# EasyEDA Pro project G474VET6_V3.1.eprj

# Schematic Schematic1
Board Name: Board1; Page Size: A3
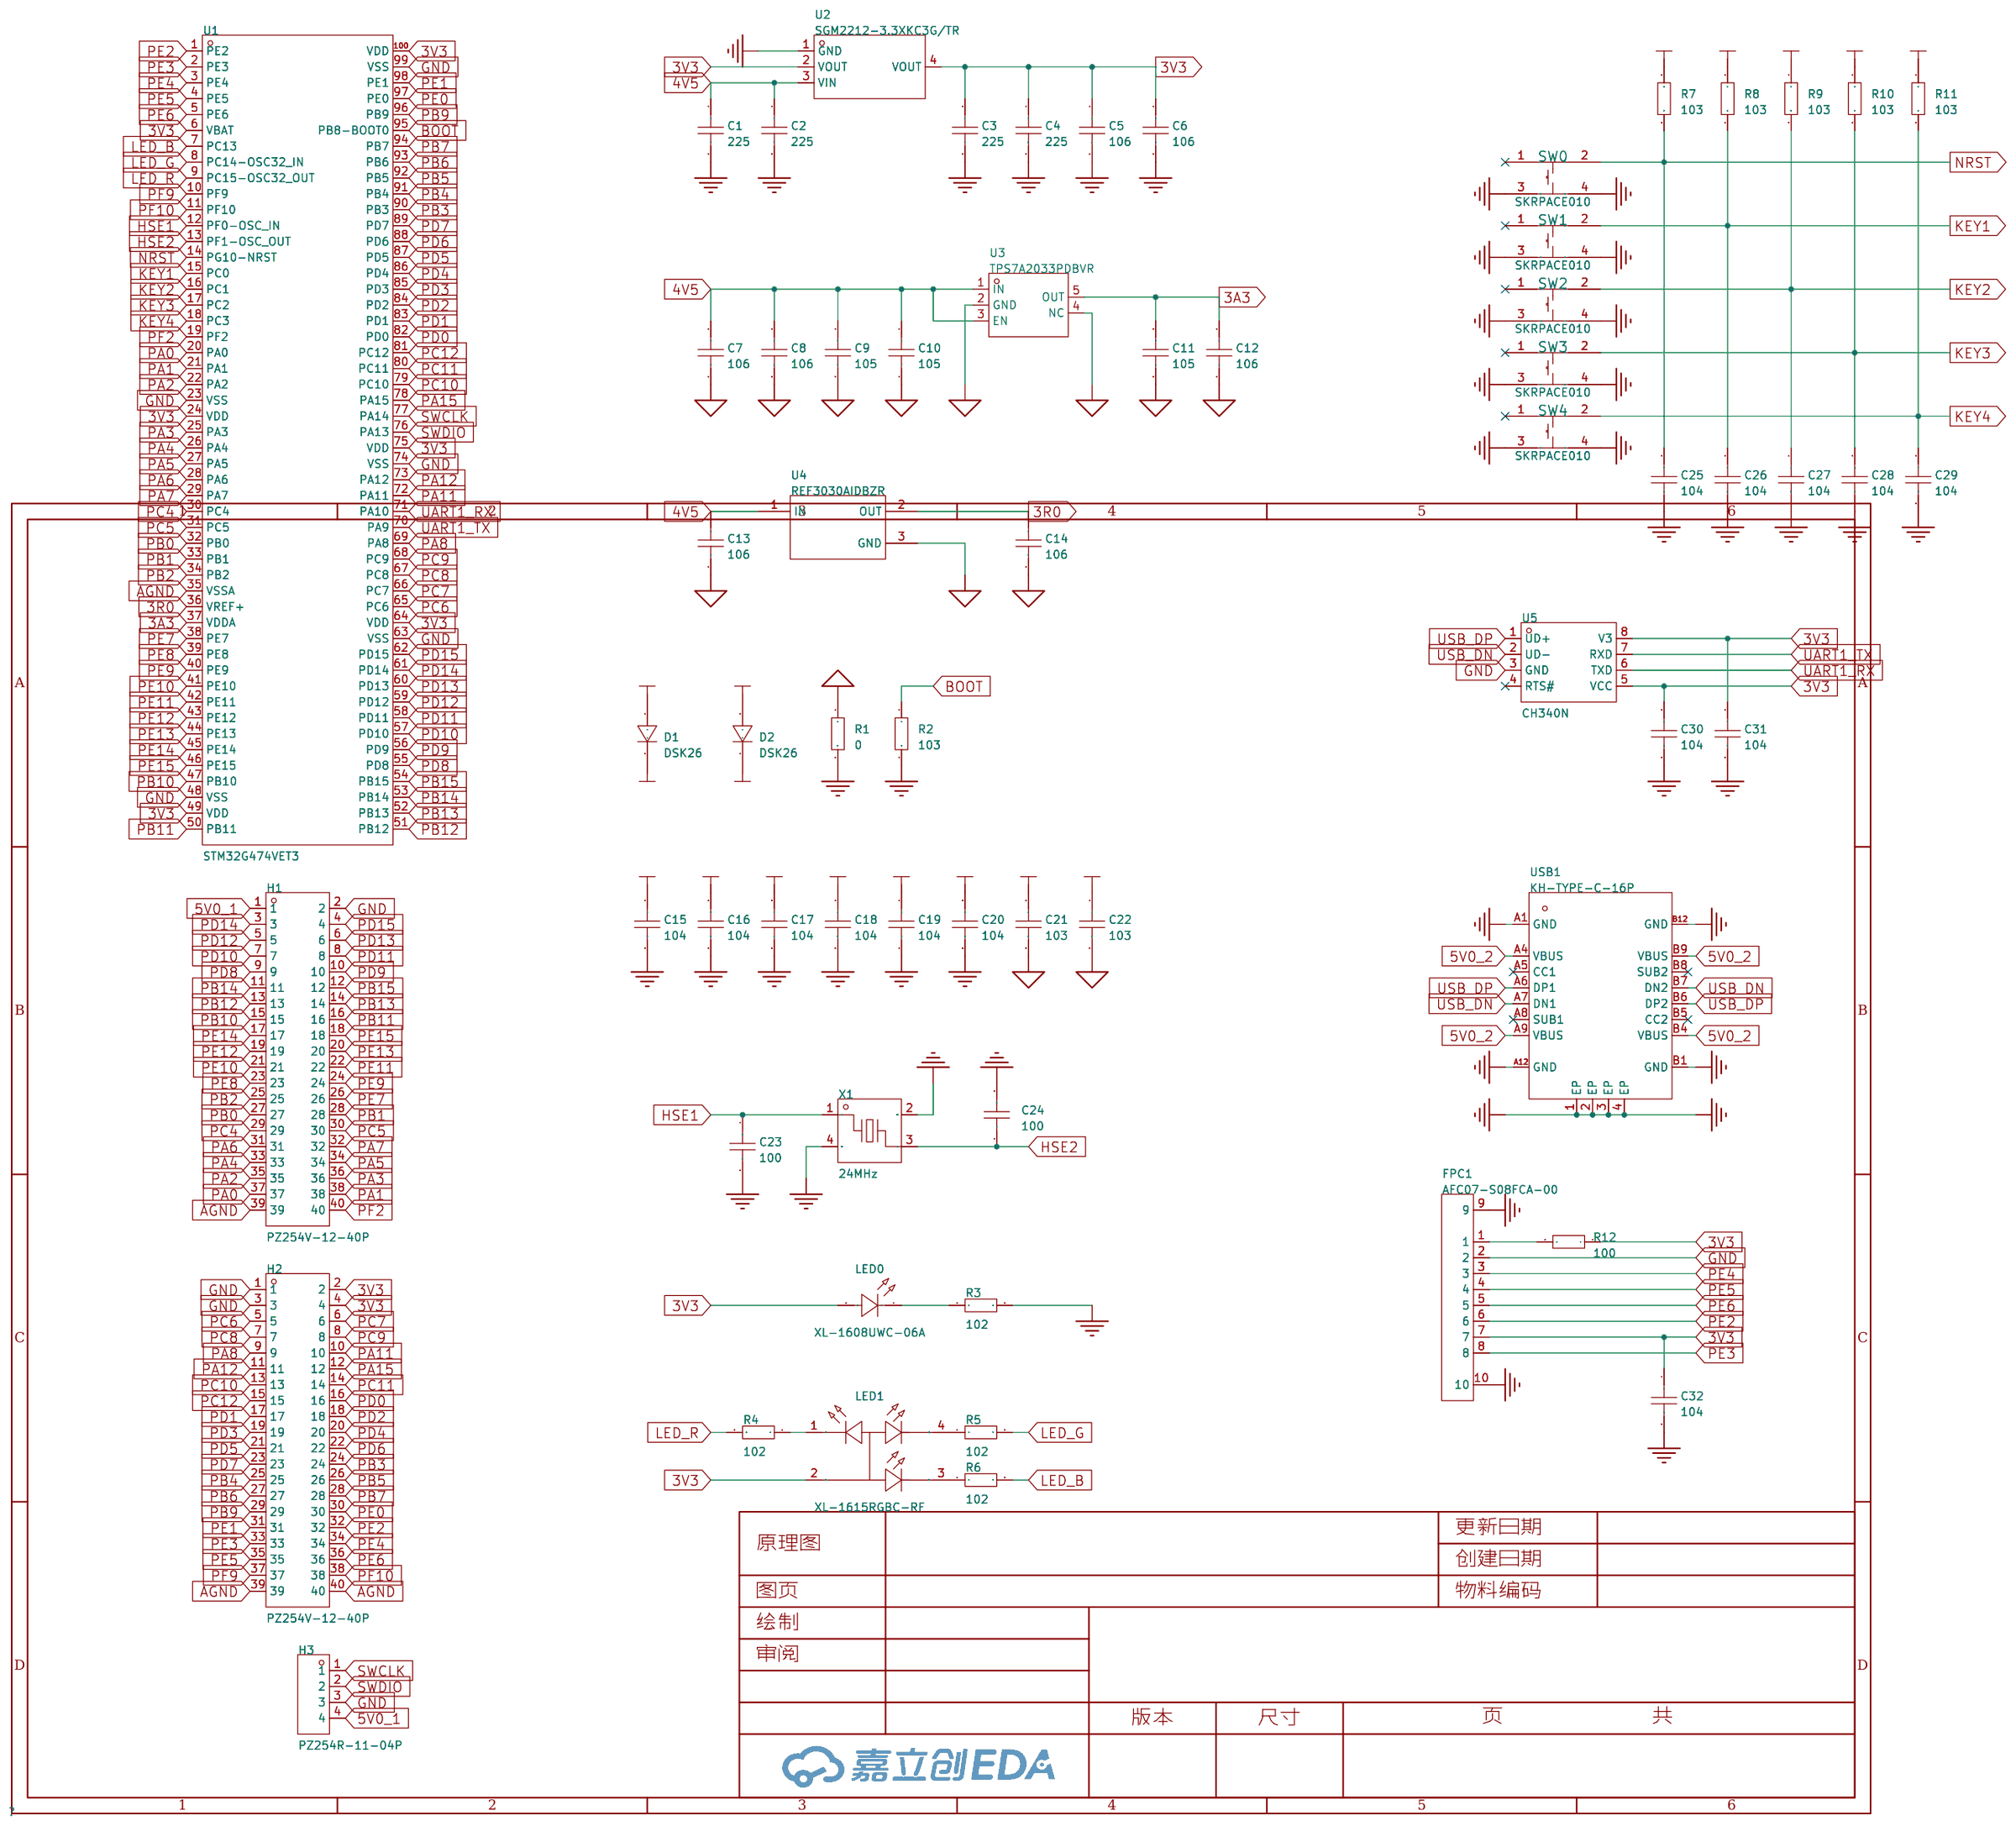
[diagram p0: schematic sheet]

## Parts
C1  225  [C0603]
C2  225  [C0603]
C3  225  [C0603]
C4  225  [C0603]
C5  106  [C0603]
C6  106  [C0603]
C7  106  [C0603]
C8  106  [C0603]
C9  105  [C0603]
C10  105  [C0603]
C11  105  [C0603]
C12  106  [C0603]
C13  106  [C0603]
C14  106  [C0603]
C15  104  [C0603]
C16  104  [C0603]
C17  104  [C0603]
C18  104  [C0603]
C19  104  [C0603]
C20  104  [C0603]
C21  103  [C0603]
C22  103  [C0603]
C23  100  [C0603]
C24  100  [C0603]
C25  104  [C0603]
C26  104  [C0603]
C27  104  [C0603]
C28  104  [C0603]
C29  104  [C0603]
C30  104  [C0603]
C31  104  [C0603]
C32  104  [C0603]
D1  DSK26  [SOD-123_L2.8-W1.8-LS3.7-RD]
D2  DSK26  [SOD-123_L2.8-W1.8-LS3.7-RD]
FPC1  AFC07-S08FCA-00  [FPC-SMD_AFC07-S08FCA-00]
H1  PZ254V-12-40P  [HDR-TH_40P-P2.54-V-M-R2-C20-S2.54_2-146257-0]
H2  PZ254V-12-40P  [HDR-TH_40P-P2.54-V-M-R2-C20-S2.54_2-146257-0]
H3  PZ254R-11-04P  [HDR-TH_4P-P2.54-H-M-W10.4]
LED0  XL-1608UWC-06A  [LED0603-RD_1]
LED1  XL-1615RGBC-RF  [LED-ARRAY-SMD_4P-L1.6-W1.5-BR_XL-1615RGBC-RF]
R1  0  [R0603]
R2  103  [R0603]
R3  102  [R0603]
R4  102  [R0603]
R5  102  [R0603]
R6  102  [R0603]
R7  103  [R0603]
R8  103  [R0603]
R9  103  [R0603]
R10  103  [R0603]
R11  103  [R0603]
R12  100  [R0603]
SW0  SKRPACE010  [KEY-SMD_4P-L4.2-W3.2-P2.20-LS4.6]
SW1  SKRPACE010  [KEY-SMD_4P-L4.2-W3.2-P2.20-LS4.6]
SW2  SKRPACE010  [KEY-SMD_4P-L4.2-W3.2-P2.20-LS4.6]
SW3  SKRPACE010  [KEY-SMD_4P-L4.2-W3.2-P2.20-LS4.6]
SW4  SKRPACE010  [KEY-SMD_4P-L4.2-W3.2-P2.20-LS4.6]
U1  STM32G474VET3  [LQFP-100_L14.0-W14.0-P0.50-LS16.0-BL]
U2  SGM2212-3.3XKC3G/TR  [SOT-223-3_L6.5-W3.4-P2.30-LS7.0-BR]
U3  TPS7A2033PDBVR  [SOT-23-5_L2.9-W1.6-P0.95-LS2.8-BR]
U4  REF3030AIDBZR  [SOT-23-3_L2.9-W1.6-P1.90-LS2.8-BR]
U5  CH340N  [SOP-8_L4.9-W3.9-P1.27-LS6.0-BL]
USB1  KH-TYPE-C-16P  [USB-C-SMD_KH-TYPE-C-16P]
X1  24MHz  [CRYSTAL-SMD_4P-L2.0-W1.6-BL]

## Library data of the parts
C1-C32 = CAP_0603: Supplier Footprint: 0603
D1 D2 = DSK26_C50553: LCSC Part Name: 电压:60V 电流:2A; Supplier Part: C50553; Manufacturer: MDD(辰达半导体); Supplier Footprint: SOD-123FL; JLCPCB Part Class: 扩展库; Datasheet: https://atta.szlcsc.com/upload/public/pdf/source/20230823/D3EA44505E795B66956504010A0876FD.pdf; Supplier: LCSC; Diode Configuration: 独立式; Forward Voltage (Vf@If): 700mV@2A; Reverse Voltage (Vr): 60V; Rectified Current: 2A; Reverse Leakage Current (Ir): 500uA@60V
FPC1 = AFC07-S08FCA-00: LCSC Part Name: 间距:0.5mm P数:8P 抽屉式 下接; Supplier Part: C262555; Manufacturer: JS(钜硕电子); Supplier Footprint: SMD,P=0.5mm,卧贴; JLCPCB Part Class: 扩展库; Datasheet: https://atta.szlcsc.com/upload/public/pdf/source/20190726/C11047_78689421E6D6672DE8D11ECCF89B3729.pdf; Supplier: LCSC; Locking Feature: 抽屉式; Contact Type: 下接; Number of Contacts: 8P; Pitch: 0.5mm; Mounting Type: 卧贴; FFC, FCB Thickness: 0.3mm; Height Above Board: 2mm
H1 H2 = PZ254V-12-40P: LCSC Part Name: 排针2.54mm间距 双排 2x20P 直插 方针; Supplier Part: C22465944; Manufacturer: XFCN(兴飞); Supplier Footprint: 插件,P=2.54mm; JLCPCB Part Class: 扩展库; Datasheet: https://atta.szlcsc.com/upload/public/pdf/source/20240617/7BDC3EEBCF4C501A0924363F71CB3FB4.pdf; Supplier: LCSC
H3 = PZ254R-11-04P: LCSC Part Name: 间距:2.54mm 1x4P 弯插 方针; Supplier Part: C492412; Manufacturer: XFCN(兴飞); Supplier Footprint: 弯插,P=2.54mm; JLCPCB Part Class: 扩展库; Datasheet: https://atta.szlcsc.com/upload/public/pdf/source/20200309/C492412_B0EFFC1946AB079B8871416C4A09EF6C.pdf; Supplier: LCSC; Pin Structure: 1x4P; Pitch: 2.54mm; Circluar Pins/Square Pins: 方针; Mounting Type: 弯插; Number of Rows: 单排; Number of Pins: 4P; Length of Mating Pin: 6mm; Insulation Height: 2.5mm; Contact Material: 黄铜; Operating Temperature Range: -40℃~+105℃; Color: 黑色
LED0 = XL-1608UWC-06A: Supplier Part: C7371902; Manufacturer: XINGLIGHT(成兴光); Supplier Footprint: 0603; JLCPCB Part Class: 扩展库; Datasheet: https://atta.szlcsc.com/upload/public/pdf/source/20240218/5027756BA733C769FB74797569466480.pdf; Supplier: LCSC; Emitted Color: 白色; Forward Voltage (VF): 2.7V~3.1V; Power Dissipation: 75mW; Forward Current: 5mA; Lens Color: 黄色透镜; Color Temperature: 14000K; Luminous Intensity: 380mcd; Viewing Angle: 120°; Mounting Sytle: 正贴
LED1 = XL-1615RGBC-RF: Supplier Part: C965840; Manufacturer: XINGLIGHT(成兴光); Supplier Footprint: 0606; JLCPCB Part Class: 扩展库; Datasheet: https://atta.szlcsc.com/upload/public/pdf/source/20221102/F1B1FC7E45BA82C0C0D2B0679BEE9200.pdf; Supplier: LCSC
R1-R12 = Res_0603: Supplier Footprint: 0603
SW0-SW4 = SKRPACE010: LCSC Part Name: 4.2*3.2*2.5mm 立贴 轻触开关; Supplier Part: C139797; Manufacturer: ALPSALPINE(阿尔卑斯阿尔派); Supplier Footprint: SMD; JLCPCB Part Class: 扩展库; Datasheet: https://atta.szlcsc.com/upload/public/pdf/source/20171113/C139797_15105612676371115729.pdf; Supplier: LCSC; Circuit: 单刀单掷; Actuator Style: 椭圆形按钮; Mounting Style: 立贴; Switch Length: 4.2mm; Switch Width: 3.2mm; Switch Height: 2.5mm; Contact Current: 50mA; Voltage Rating (DC): 16V
U1 = STM32G474VET3: LCSC Part Name: 带DSP和FPU的170MHz主流ARM Cortex-M4 MCU，具有512 KB Flash存储器、数学加速器、高分辨率定时器和高模拟电平集成; Supplier Part: C2970837; Manufacturer: ST(意法半导体); Supplier Footprint: LQFP-100(14x14); JLCPCB Part Class: Extended Part; Datasheet: https://atta.szlcsc.com/upload/public/pdf/source/20221107/1C05EB05E61A1774C91EF6DD7B13AC34.pdf; Supplier: LCSC; Program Storage Size: 512KB; GPIO Ports Number: 86; Operating Voltage Range: 1.71V~3.6V; CPU Maximum Speed: 170MHz; Operating Temperature Range: -40℃~+125℃; ADC (Bit): 12bit; DAC (Bit): 12bit; Watchdog: 有; Infrared Data Association: 有; Low-Voltage Detect: 有; Direct Memory Access: 有; Internal Oscillator: 有
U2 = SGM2212-3.3XKC3G/TR_C3294699: Supplier Part: C3294699; Manufacturer: SGMICRO(圣邦微); Supplier Footprint: SOT-223-3; JLCPCB Part Class: 扩展库; Supplier: LCSC
U3 = TPS7A2033PDBVR: LCSC Part Name: 具有高 PSRR 的 300mA、超低噪声、低 IQ、低压降 (LDO) 线性稳压器; Supplier Part: C2862740; Manufacturer: TI(德州仪器); Supplier Footprint: SOT-23-5; JLCPCB Part Class: 扩展库; Datasheet: https://www.ti.com/cn/lit/gpn/tps7a20; Supplier: LCSC; Output Type: 固定; Maximum Input Voltage: 6V; Output Voltage: 3.3V; Output Current: 300mA; Dropout Voltage: 140mV@(300mA); standby current: 15uA; Feature: 防静电保护；软启动；浪涌保护；低ESR；热保护(TSD)；欠压闭锁；过流保护(OCP)；带使能；防倒灌; Operating Temperature: -40℃~+125℃@(Tj); Output Polarity: 正极; Number of Outputs: 1
U4 = REF3030AIDBZR: Supplier Part: C38423; Manufacturer: TI(德州仪器); Supplier Footprint: SOT-23; JLCPCB Part Class: 扩展库; Datasheet: https://www.ti.com/cn/lit/gpn/ref3020; Supplier: LCSC; Output Type: 固定; Input Voltage: 3.05V~5.5V; Output Voltage: 3V; Output Current: 25mA; Tolerance: ±0.2%; Temperature Coefficient: 75ppm/℃; Reference Type: 串联; Supply Current: 50uA; Noise - 10Hz to 10kHz: 94uVrms; Operating Temperature: -40℃~+125℃@(Ta)
U5 = CH340N: LCSC Part Name: USB转串口芯片 CH340; Supplier Part: C2977777; Manufacturer: WCH(南京沁恒); Supplier Footprint: SOP-8; JLCPCB Part Class: Extended Part; Datasheet: https://atta.szlcsc.com/upload/public/pdf/source/20230530/6E401E9554E9F5311886CC8B3F89B62E.pdf; Supplier: LCSC
USB1 = KH-TYPE-C-16P: LCSC Part Name: Type-C 母 卧贴; Supplier Part: C709357; Manufacturer: kinghelm(金航标); Supplier Footprint: SMD; JLCPCB Part Class: Extended Part; Datasheet: https://atta.szlcsc.com/upload/public/pdf/source/20200911/C709357_AA8DCEB38BB20E3035A7ED7AE7667837.pdf; Supplier: LCSC; Connector Type: Type-C; Gender: 母; Number of Ports: 1; Number of Contacts: 16P; Mounting Style: 卧贴; Current Rating - Power (Max): 3A; Operating Temperature Range: -40℃~+85℃
X1 = XL7EL89CMI-111YLC-24M: LCSC Part Name: 24MHz ±10ppm 10pF; Supplier Part: C2965581; Manufacturer: YXC(扬兴晶振); Supplier Footprint: SMD2016-4P; JLCPCB Part Class: 扩展库; Datasheet: https://atta.szlcsc.com/upload/public/pdf/source/20240329/C26C9A15A73CBCFBF373B30A8E126750.pdf; Supplier: LCSC; Crystal Type: 贴片晶振; Normal temperature Frequency Tolerance: ±10ppm; External load capacitor: 10pF; Frequency Stability(Full temperature range): ±20ppm; Operating Temperature: -40℃~+85℃

## Nets
3V3: C3.1 C4.1 C5.1 C6.1 C15.1 C16.1 C17.1 C18.1 C19.1 C20.1 C30.1 C31.1 C32.1 FPC1.7 H2.2 H2.4 LED0.2(A) LED1.2(COM+) R7.1 R8.1 R9.1 R10.1 R11.1 R12.1 U1.6(VBAT) U1.24(VDD) U1.49(VDD) U1.64(VDD) U1.75(VDD) U1.100(VDD) U2.2(VOUT) U2.4(VOUT) U5.5(VCC) U5.8(V3)
4V5: C1.1 C2.1 C7.1 C8.1 C9.1 C10.1 C13.1 D1.1(K) D2.1(K) U2.3(VIN) U3.1(IN) U3.3(EN) U4.1(IN)
5V0_1: D1.2(A) H1.1 H3.4
5V0_2: D2.2(A) USB1.A4(VBUS) USB1.A9(VBUS) USB1.B4(VBUS) USB1.B9(VBUS)
AGND: C7.2 C8.2 C9.2 C10.2 C11.2 C12.2 C13.2 C14.2 C21.2 C22.2 H1.39 H2.39 H2.40 R1.1 U1.35(VSSA) U3.2(GND) U3.4(NC) U4.3(GND)
GND: C1.2 C2.2 C3.2 C4.2 C5.2 C6.2 C15.2 C16.2 C17.2 C18.2 C19.2 C20.2 C23.2 C24.2 C25.2 C26.2 C27.2 C28.2 C29.2 C30.2 C31.2 C32.2 FPC1.2 FPC1.9 FPC1.10 H1.2 H2.1 H2.3 H3.3 R1.2 R2.2 R3.2 SW0.3 SW0.4 SW1.3 SW1.4 SW2.3 SW2.4 SW3.3 SW3.4 SW4.3 SW4.4 U1.23(VSS) U1.48(VSS) U1.63(VSS) U1.74(VSS) U1.99(VSS) U2.1(GND) U5.3(GND) USB1.1(EP) USB1.2(EP) USB1.3(EP) USB1.4(EP) USB1.A1(GND) USB1.A12(GND) USB1.B1(GND) USB1.B12(GND) X1.2(GND) X1.4(GND)
3A3: C11.1 C12.1 C21.1 U1.37(VDDA) U3.5(OUT)
3R0: C14.1 C22.1 U1.36(VREF+) U4.2(OUT)
BOOT: R2.1 U1.95(PB8-BOOT0)
HSE1: C23.1 U1.12(PF0-OSC_IN) X1.1
HSE2: C24.1 U1.13(PF1-OSC_OUT) X1.3
KEY1: C26.1 R8.2 SW1.2 U1.15(PC0)
KEY2: C27.1 R9.2 SW2.2 U1.16(PC1)
KEY3: C28.1 R10.2 SW3.2 U1.17(PC2)
KEY4: C29.1 R11.2 SW4.2 U1.18(PC3)
LED_B: R6.2 U1.7(PC13)
LED_G: R5.2 U1.8(PC14-OSC32_IN)
LED_R: R4.2 U1.9(PC15-OSC32_OUT)
NRST: C25.1 R7.2 SW0.2 U1.14(PG10-NRST)
PA0: H1.37 U1.20(PA0)
PA1: H1.38 U1.21(PA1)
PA2: H1.35 U1.22(PA2)
PA3: H1.36 U1.25(PA3)
PA4: H1.33 U1.26(PA4)
PA5: H1.34 U1.27(PA5)
PA6: H1.31 U1.28(PA6)
PA7: H1.32 U1.29(PA7)
PA8: H2.9 U1.69(PA8)
PA11: H2.10 U1.72(PA11)
PA12: H2.11 U1.73(PA12)
PA15: H2.12 U1.78(PA15)
PB0: H1.27 U1.32(PB0)
PB1: H1.28 U1.33(PB1)
PB2: H1.25 U1.34(PB2)
PB3: H2.24 U1.90(PB3)
PB4: H2.25 U1.91(PB4)
PB5: H2.26 U1.92(PB5)
PB6: H2.27 U1.93(PB6)
PB7: H2.28 U1.94(PB7)
PB9: H2.29 U1.96(PB9)
PB10: H1.15 U1.47(PB10)
PB11: H1.16 U1.50(PB11)
PB12: H1.13 U1.51(PB12)
PB13: H1.14 U1.52(PB13)
PB14: H1.11 U1.53(PB14)
PB15: H1.12 U1.54(PB15)
PC4: H1.29 U1.30(PC4)
PC5: H1.30 U1.31(PC5)
PC6: H2.5 U1.65(PC6)
PC7: H2.6 U1.66(PC7)
PC8: H2.7 U1.67(PC8)
PC9: H2.8 U1.68(PC9)
PC10: H2.13 U1.79(PC10)
PC11: H2.14 U1.80(PC11)
PC12: H2.15 U1.81(PC12)
PD0: H2.16 U1.82(PD0)
PD1: H2.17 U1.83(PD1)
PD2: H2.18 U1.84(PD2)
PD3: H2.19 U1.85(PD3)
PD4: H2.20 U1.86(PD4)
PD5: H2.21 U1.87(PD5)
PD6: H2.22 U1.88(PD6)
PD7: H2.23 U1.89(PD7)
PD8: H1.9 U1.55(PD8)
PD9: H1.10 U1.56(PD9)
PD10: H1.7 U1.57(PD10)
PD11: H1.8 U1.58(PD11)
PD12: H1.5 U1.59(PD12)
PD13: H1.6 U1.60(PD13)
PD14: H1.3 U1.61(PD14)
PD15: H1.4 U1.62(PD15)
PE0: H2.30 U1.97(PE0)
PE1: H2.31 U1.98(PE1)
PE2: FPC1.6 H2.32 U1.1(PE2)
PE3: FPC1.8 H2.33 U1.2(PE3)
PE4: FPC1.3 H2.34 U1.3(PE4)
PE5: FPC1.4 H2.35 U1.4(PE5)
PE6: FPC1.5 H2.36 U1.5(PE6)
PE7: H1.26 U1.38(PE7)
PE8: H1.23 U1.39(PE8)
PE9: H1.24 U1.40(PE9)
PE10: H1.21 U1.41(PE10)
PE11: H1.22 U1.42(PE11)
PE12: H1.19 U1.43(PE12)
PE13: H1.20 U1.44(PE13)
PE14: H1.17 U1.45(PE14)
PE15: H1.18 U1.46(PE15)
PF2: H1.40 U1.19(PF2)
PF9: H2.37 U1.10(PF9)
PF10: H2.38 U1.11(PF10)
SWCLK: H3.1 U1.77(PA14)
SWDIO: H3.2 U1.76(PA13)
UART1_RX: U1.71(PA10) U5.6(TXD)
UART1_TX: U1.70(PA9) U5.7(RXD)
USB_DN: U5.2(UD-) USB1.A7(DN1) USB1.B7(DN2)
USB_DP: U5.1(UD+) USB1.A6(DP1) USB1.B6(DP2)
$1N5162: LED0.1(K) R3.1
$1N5238: LED1.1(R-) R4.1
$1N5301: LED1.4(G-) R5.1
$1N5327: LED1.3(B-) R6.1
$1N6659: FPC1.1 R12.2

Not connected (* = marked no-connect by the designer): SW0 1*; SW1 1*; SW2 1*; SW3 1*; SW4 1*; U5 4(RTS#)*; USB1 A5(CC1)* A8(SUB1)* B5(CC2)* B8(SUB2)*

# Board PCB1
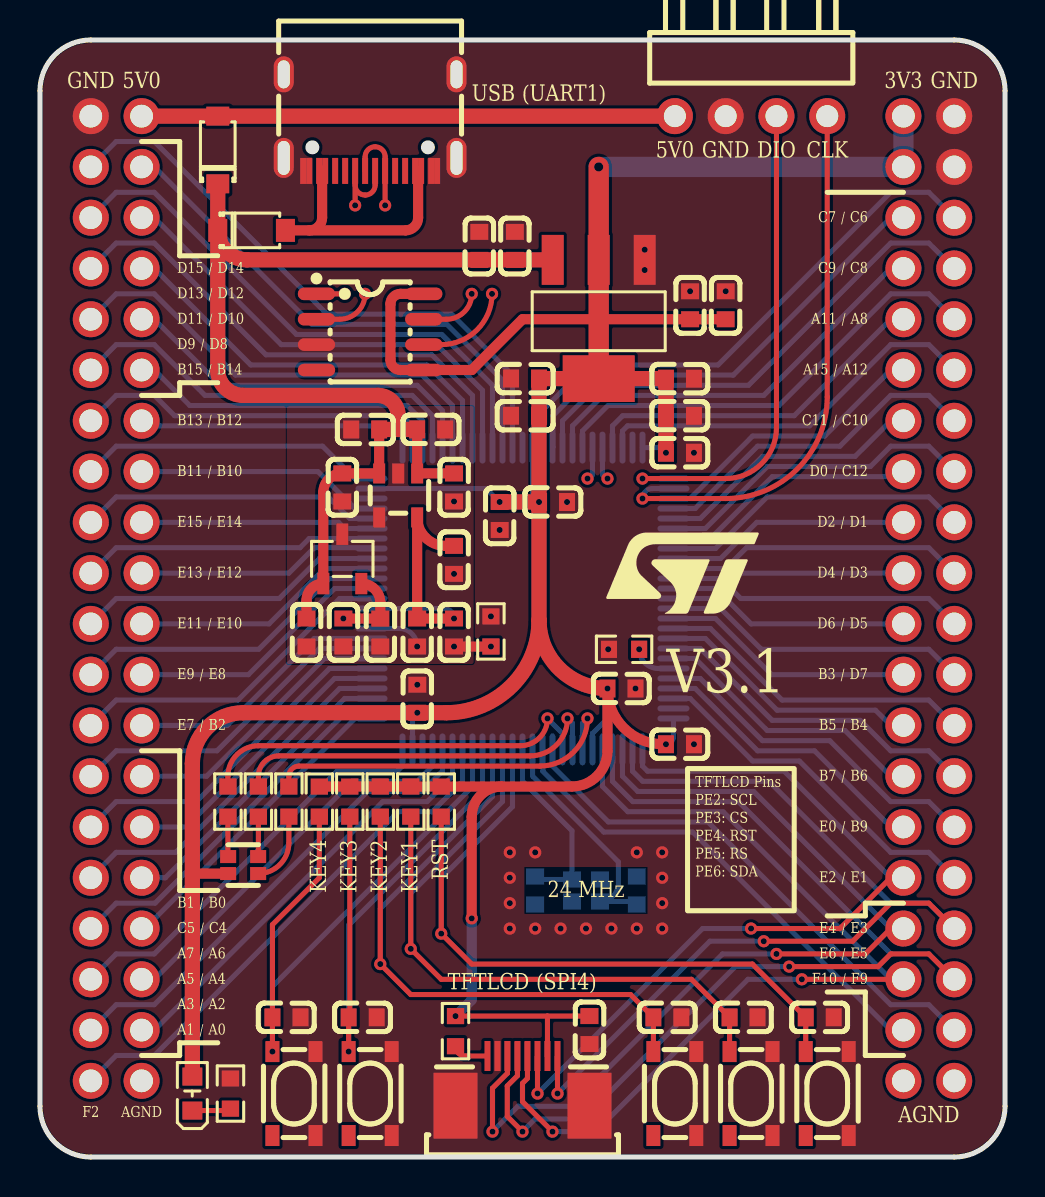
[diagram p1: board, top side]
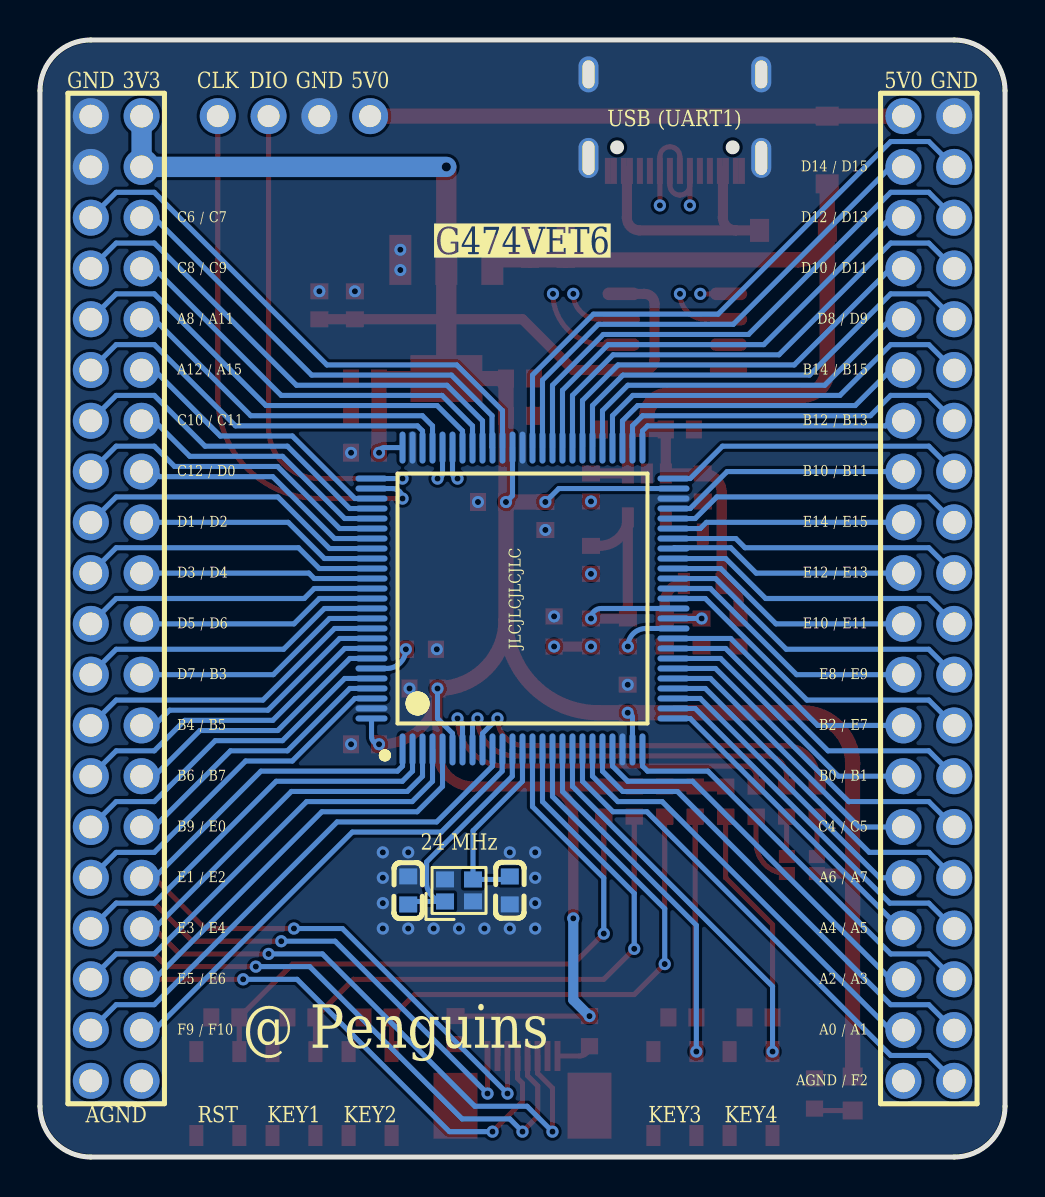
[diagram p2: board, bottom side, seen from below]

Outline 48.26 x 55.88 mm; copper layers: Top Layer, Inner1, 内层2, Bottom Layer. Coordinates in mm from the lower left corner of the outline.
Outline path: 0,53.34 0,2.54 arc(0.74,0.74) 2.54,0 45.72,0 arc(47.52,0.74) 48.26,2.54 48.26,53.34 arc(47.52,55.14) 45.72,55.88 2.54,55.88 arc(0.74,55.14) 0,53.34
Stack: Top Layer 0.035mm 外层铜厚1oz / Dielectric1 0.2104mm 7628 RC49% 8.6mil / Inner1 0.0152mm 内层铜厚 / Dielectric2 1.065mm 1.1mm H/HOZ Copper / 内层2 0.0152mm 内层铜厚 / Dielectric3 0.2104mm 7628 RC49% 8.6mil / Bottom Layer 0.035mm 外层铜厚1oz

## Design rules (mm)
template: 自定义配置
spacing copperThickness1oz (default): track to track 0.102, other pairs 0.152 to 0.3
spacing copperThickness2oz: track to track 0.203, other pairs 0.152 to 0.3
track width copperThickness1oz (default): min 0.127, default 0.254, max 2.54
track width copperThickness2oz: min 0.203, default 0.254, max 2.54
differential pair differentialPair (default): width min 0.127, default 0.254, max 2.54; gap min 0.152, default 0.152
via viaSize (default): diameter min 0.5, default 0.61, max 10; hole min 0.3, default 0.305, max 6.3

## Placement (name value [footprint] x y rotation side)
C1  225  [C0603]  21.97 45.58 90 top
C2  225  [C0603]  23.75 45.58 90 top
C3  225  [C0603]  24.26 38.94 180 top
C4  225  [C0603]  32 38.94 0 top
C5  106  [C0603]  24.26 37.08 180 top
C6  106  [C0603]  32 37.08 0 top
C7  106  [C0603]  16.26 36.4 180 top
C8  106  [C0603]  19.56 36.4 0 top
C9  105  [C0603]  15.12 33.5 270 top
C10  105  [C0603]  20.71 33.5 270 top
C11  105  [C0603]  20.71 29.87 270 top
C12  106  [C0603]  18.86 26.24 270 top
C13  106  [C0603]  13.33 26.24 270 top
C14  106  [C0603]  17.02 26.24 270 top
C15  104  [C0603]  18.87 22.92 90 top
C16  104  [C0603]  22.99 32.07 270 top
C17  104  [C0603]  25.66 32.77 0 top
C18  104  [C0603]  32 35.23 0 top
C19  104  [C0603]  32 20.65 0 top
C20  104  [C0603]  29.08 23.44 0 top
C21  103  [C0603]  20.71 26.24 270 top
C22  103  [C0603]  15.17 26.24 270 top
C23  100  [C0603]  29.84 13.33 90 bottom
C24  100  [C0603]  24.76 13.33 270 bottom
C25  104  [C0603]  39 6.98 0 top
C26  104  [C0603]  35.19 6.98 0 top
C27  104  [C0603]  31.38 6.98 0 top
C28  104  [C0603]  16.13 6.98 0 top
C29  104  [C0603]  12.32 6.98 0 top
C30  104  [C0603]  32.51 42.61 90 top
C31  104  [C0603]  34.29 42.61 90 top
C32  104  [C0603]  27.48 6.35 270 top
D1  DSK26  [SOD-123_L2.8-W1.8-LS3.7-RD]  8.89 50.38 90 top
D2  DSK26  [SOD-123_L2.8-W1.8-LS3.7-RD]  10.58 46.36 0 top
FPC1  AFC07-S08FCA-00  [FPC-SMD_AFC07-S08FCA-00]  24.13 3.81 0 top
H1  PZ254V-12-40P  [HDR-TH_40P-P2.54-V-M-R2-C20-S2.54_2-146257-0]  3.81 27.94 270 bottom
H2  PZ254V-12-40P  [HDR-TH_40P-P2.54-V-M-R2-C20-S2.54_2-146257-0]  44.45 27.94 270 bottom
H3  PZ254R-11-04P  [HDR-TH_4P-P2.54-H-M-W10.4]  35.56 52.07 180 top
LED0  XL-1608UWC-06A  [LED0603-RD_1]  7.62 3.18 90 top
LED1  XL-1615RGBC-RF  [LED-ARRAY-SMD_4P-L1.6-W1.5-BR_XL-1615RGBC-RF]  10.16 14.61 180 top
R1  0  [R0603]  22.55 26.29 90 top
R2  103  [R0603]  29.21 25.4 180 top
R3  102  [R0603]  9.53 3.18 90 top
R4  102  [R0603]  9.4 17.78 90 top
R5  102  [R0603]  10.92 17.78 90 top
R6  102  [R0603]  12.45 17.78 90 top
R7  103  [R0603]  20.07 17.78 270 top
R8  103  [R0603]  18.54 17.78 270 top
R9  103  [R0603]  17.02 17.78 270 top
R10  103  [R0603]  15.49 17.78 270 top
R11  103  [R0603]  13.97 17.78 270 top
R12  100  [R0603]  20.78 6.3 270 top
SW0  SKRPACE010  [KEY-SMD_4P-L4.2-W3.2-P2.20-LS4.6]  39.37 3.18 90 top
SW1  SKRPACE010  [KEY-SMD_4P-L4.2-W3.2-P2.20-LS4.6]  35.56 3.18 90 top
SW2  SKRPACE010  [KEY-SMD_4P-L4.2-W3.2-P2.20-LS4.6]  31.75 3.18 90 top
SW3  SKRPACE010  [KEY-SMD_4P-L4.2-W3.2-P2.20-LS4.6]  16.51 3.18 90 top
SW4  SKRPACE010  [KEY-SMD_4P-L4.2-W3.2-P2.20-LS4.6]  12.7 3.18 90 top
U1  STM32G474VET3  [LQFP-100_L14.0-W14.0-P0.50-LS16.0-BL]  24.13 27.94 180 bottom
U2  SGM2212-3.3XKC3G/TR  [SOT-223-3_L6.5-W3.4-P2.30-LS7.0-BR]  27.94 41.91 90 top
U3  TPS7A2033PDBVR  [SOT-23-5_L2.9-W1.6-P0.95-LS2.8-BR]  17.91 33.1 90 top
U4  REF3030AIDBZR  [SOT-23-3_L2.9-W1.6-P1.90-LS2.8-BR]  15.12 29.92 270 top
U5  CH340N  [SOP-8_L4.9-W3.9-P1.27-LS6.0-BL]  16.51 41.27 270 top
USB1  KH-TYPE-C-16P  [USB-C-SMD_KH-TYPE-C-16P]  16.51 51.75 180 top
X1  24MHz  [CRYSTAL-SMD_4P-L2.0-W1.6-BL]  27.31 13.33 180 bottom

## Footprints (pads in the part's own frame, mm; a bottom-side part is the same pattern mirrored in y, then rotated)
C0603
  rect 0.8x0.9 smd: 1(-0.7,0) 2(0.7,0)
CRYSTAL-SMD_4P-L2.0-W1.6-BL
  rect 0.9x0.8 smd: 1(-0.7,-0.55) 2(0.7,-0.55) 3(0.7,0.55) 4(-0.7,0.55)
FPC-SMD_AFC07-S08FCA-00
  rect 0.3x1.5 smd: 1(-1.751,1.243) 2(-1.252,1.243) 3(-0.753,1.243) 4(-0.253,1.243) 5(0.248,1.243) 6(0.749,1.243) 7(1.248,1.243) 8(1.749,1.243)
  rect 2.2x3.3 smd: 9(-3.35,-1.243) 10(3.35,-1.243)
HDR-TH_4P-P2.54-H-M-W10.4
  round 1.8 hole 1.1: 1(-3.81,0) 2(-1.27,0) 3(1.27,0) 4(3.81,0)
HDR-TH_40P-P2.54-V-M-R2-C20-S2.54_2-146257-0
  round 1.8 hole 1.14x1.1: 1(-24.13,-1.27) 2(-24.13,1.27) 3(-21.59,-1.27) 4(-21.59,1.27) 5(-19.05,-1.27) 6(-19.05,1.27) 7(-16.51,-1.27) 8(-16.51,1.27) 9(-13.97,-1.27) 10(-13.97,1.27) 11(-11.43,-1.27) 12(-11.43,1.27) 13(-8.89,-1.27) 14(-8.89,1.27) 15(-6.35,-1.27) 16(-6.35,1.27) 17(-3.81,-1.27) 18(-3.81,1.27) 19(-1.27,-1.27) 20(-1.27,1.27) 21(1.27,-1.27) 22(1.27,1.27) 23(3.81,-1.27) 24(3.81,1.27) 25(6.35,-1.27) 26(6.35,1.27) 27(8.89,-1.27) 28(8.89,1.27) 29(11.43,-1.27) 30(11.43,1.27) 31(13.97,-1.27) 32(13.97,1.27) 33(16.51,-1.27) 34(16.51,1.27) 35(19.05,-1.27) 36(19.05,1.27) 37(21.59,-1.27) 38(21.59,1.27) 39(24.13,-1.27) 40(24.13,1.27)
KEY-SMD_4P-L4.2-W3.2-P2.20-LS4.6
  rect 1.05x0.7 smd: 1(-2.1,1.075) 2(2.1,1.075) 3(-2.1,-1.075) 4(2.1,-1.075)
LED0603-RD_1
  rect 0.9x1 smd: 1(-0.85,0) 2(0.85,0)
LED-ARRAY-SMD_4P-L1.6-W1.5-BR_XL-1615RGBC-RF
  rect 0.8x0.65 smd: 1(0.75,-0.425) 2(0.75,0.425) 3(-0.75,0.425) 4(-0.75,-0.425)
LQFP-100_L14.0-W14.0-P0.50-LS16.0-BL
  oval 0.3x1.6 smd: 1(-6,-7.55) 2(-5.5,-7.55) 3(-5,-7.55) 4(-4.5,-7.55) 5(-4,-7.55) 6(-3.5,-7.55) 7(-3,-7.55) 8(-2.5,-7.55) 9(-2,-7.55) 10(-1.5,-7.55) 11(-1,-7.55) 12(-0.5,-7.55) 13(0,-7.55) 14(0.5,-7.55) 15(1,-7.55) 16(1.5,-7.55) 17(2,-7.55) 18(2.5,-7.55) 19(3,-7.55) 20(3.5,-7.55) 21(4,-7.55) 22(4.5,-7.55) 23(5,-7.55) 24(5.5,-7.55) 25(6,-7.55) 51(6,7.55) 52(5.5,7.55) 53(5,7.55) 54(4.5,7.55) 55(4,7.55) 56(3.5,7.55) 57(3,7.55) 58(2.5,7.55) 59(2,7.55) 60(1.5,7.55) 61(1,7.55) 62(0.5,7.55) 63(0,7.55) 64(-0.5,7.55) 65(-1,7.55) 66(-1.5,7.55) 67(-2,7.55) 68(-2.5,7.55) 69(-3,7.55) 70(-3.5,7.55) 71(-4,7.55) 72(-4.5,7.55) 73(-5,7.55) 74(-5.5,7.55) 75(-6,7.55)
  oval 1.6x0.3 smd: 26(7.55,-6) 27(7.55,-5.5) 28(7.55,-5) 29(7.55,-4.5) 30(7.55,-4) 31(7.55,-3.5) 32(7.55,-3) 33(7.55,-2.5) 34(7.55,-2) 35(7.55,-1.5) 36(7.55,-1) 37(7.55,-0.5) 38(7.55,0) 39(7.55,0.5) 40(7.55,1) 41(7.55,1.5) 42(7.55,2) 43(7.55,2.5) 44(7.55,3) 45(7.55,3.5) 46(7.55,4) 47(7.55,4.5) 48(7.55,5) 49(7.55,5.5) 50(7.55,6) 76(-7.55,6) 77(-7.55,5.5) 78(-7.55,5) 79(-7.55,4.5) 80(-7.55,4) 81(-7.55,3.5) 82(-7.55,3) 83(-7.55,2.5) 84(-7.55,2) 85(-7.55,1.5) 86(-7.55,1) 87(-7.55,0.5) 88(-7.55,0) 89(-7.55,-0.5) 90(-7.55,-1) 91(-7.55,-1.5) 92(-7.55,-2) 93(-7.55,-2.5) 94(-7.55,-3) 95(-7.55,-3.5) 96(-7.55,-4) 97(-7.55,-4.5) 98(-7.55,-5) 99(-7.55,-5.5) 100(-7.55,-6)
R0603
  rect 0.806x0.864 smd: 1(-0.753,0) 2(0.753,0)
SOD-123_L2.8-W1.8-LS3.7-RD
  rect 0.95x1.15 smd: 1(-1.692,0) 2(1.692,0)
SOP-8_L4.9-W3.9-P1.27-LS6.0-BL
  oval 0.63x1.865 smd: 1(-1.905,-2.683) 2(-0.635,-2.683) 3(0.635,-2.683) 4(1.905,-2.683) 5(1.905,2.683) 6(0.635,2.683) 7(-0.635,2.683) 8(-1.905,2.683)
SOT-23-3_L2.9-W1.6-P1.90-LS2.8-BR
  rect 1.07x0.6 smd: 1(1.235,-0.95) 2(1.235,0.95) 3(-1.235,0)
SOT-23-5_L2.9-W1.6-P0.95-LS2.8-BR
  rect 1x0.6 smd: 1(1.1,-0.95) 2(1.1,0) 3(1.1,0.95) 4(-1.1,0.95) 5(-1.1,-0.95)
SOT-223-3_L6.5-W3.4-P2.30-LS7.0-BR
  rect 2.5x1.1 smd: 1(2.97,-2.3) 2(2.97,0) 3(2.97,2.3)
  rect 2.34x3.6 smd: 4(-2.97,0)
USB-C-SMD_KH-TYPE-C-16P
  oval 1x2 hole 0.6x1.7: 1(-4.32,1.765) 2(4.32,1.765)
  oval 1x1.8 hole 0.6x1.4: 3(-4.32,-2.415) 4(4.32,-2.415)
  rect 0.3x1.3 smd: A1(-3.35,2.415) A4(-2.55,2.415) A5(-1.25,2.415) A6(-0.25,2.415) A7(0.25,2.415) A8(1.25,2.415) A9(2.55,2.415) A12(3.35,2.415) B1(3.05,2.415) B4(2.25,2.415) B5(1.75,2.415) B6(0.75,2.415) B7(-0.75,2.415) B8(-1.75,2.415) B9(-2.25,2.415) B12(-3.05,2.415)

## Nets
As in the schematic.

Pads without a net: SW0 1; SW1 1; SW2 1; SW3 1; SW4 1; U5 4; USB1 A5 A8 B5 B8

## Via types
v1: diameter 0.61, hole 0.305, Top Layer to Bottom Layer, 71 vias
v2: diameter 0.914, hole 0.457, Top Layer to Bottom Layer, 1 via

## Routing (per net, layer and track width the routed paths; a pad name or vN(x,y) marks a point on that pad's centre or on a via; arc(x,y) is an arc through that point)
3V3: length 181.7
  Top Layer w0.254: v1(20.78,7.05) 25.38,7.05 ; 25.38,7.05 C32.1 ; 25.38,7.05 FPC1.7
  Top Layer w0.508: v1(31.3,20.65) 31.17,20.65 arc(29.2,21.47) v1(28.38,23.44) 28.38,20.32 arc(27.86,19.06) 26.59,18.53 23.1,18.53 ; C31.1 C30.1 24.13,41.91 21.59,39.37 U5.5 18.03,39.37 arc(17.67,39.52) 17.53,39.88 17.53,42.67 arc(17.67,43.03) 18.03,43.18 U5.8 ; 23.1,18.53 R7.1 R8.1 R9.1 R10.1 R11.1 ; 23.1,18.53 arc(22.03,18.09) 21.59,17.03 v1(21.59,11.94) ; LED1.2 7.62,14.18
  Top Layer w0.762: LED0.2 7.62,19.69 arc(8.36,21.48) 10.16,22.22 v1(18.87,22.22) 20.32,22.22 arc(23.6,23.58) 24.96,26.86 ; v1(22.99,32.77) 24.95,32.77 v1(24.96,32.77) ; 24.96,26.86 v1(24.96,32.77) ; 24.96,26.86 arc(25.96,24.44) v1(28.38,23.44) ; v1(24.96,32.77) C5.1 C3.1 arc(24.96,38.94) 24.96,38.94 U2.4 31.3,38.94 arc(31.3,38.94) C4.1 C6.1 v1(31.3,35.23)
  Top Layer w1.016: U2.4 U2.2 v2(27.94,49.53)
  Bottom Layer w0.254: v1(22.99,32.77) 22.32,33.44 U1.49 ; U1.64 24.63,33.09 v1(24.96,32.77) ; U1.75 31.04,35.49 arc(31.23,35.41) v1(31.3,35.23) ; U1.24 18.63,21.99 arc(18.7,22.16) v1(18.87,22.22) ; U1.6 27.63,21.19 28.38,21.94 v1(28.38,23.44) ; U1.100 31.68,21.03 arc(31.57,20.76) v1(31.3,20.65)
  Bottom Layer w0.508: v1(21.59,11.94) 21.59,7.86 v1(20.78,7.05)
  Bottom Layer w1.016: H2.2 H2.4 v2(27.94,49.53)
4V5: length 56.2
  Top Layer w0.508: C8.1 U3.1 C10.1 ; C13.1 13.33,27.85 arc(13.57,28.44) U4.1 14.17,33.25 arc(14.45,33.92) C9.1 U3.3 C7.1
  Top Layer w0.762: U2.3 C2.1 C1.1 10.37,44.88 arc(9.32,45.31) D2.1 ; C7.1 17.91,36.4 ; 17.91,36.4 C8.1 ; 17.91,36.4 17.91,37.08 arc(17.61,37.8) 16.9,38.1 10.16,38.1 arc(9.26,38.47) 8.89,39.37 D2.1 ; D2.1 D1.1
5V0_1: length 26.7
  Top Layer w0.762: H3.4 D1.2 H1.1
5V0_2: length 12.7
  Top Layer w0.508: 13.47,46.36 D2.2 ; 13.47,46.36 18.28,46.36 arc(18.72,46.54) 18.91,46.99 18.91,49.33 ; 13.47,46.36 arc(13.92,46.54) 14.11,46.99 14.11,49.33
AGND: length 4.6
  Top Layer w0.508: v1(20.71,25.54) v1(22.55,25.54)
  Bottom Layer w0.254: U1.35 17.96,26.44 arc(18.6,26.18) v1(18.86,25.54)
  vias: v1(20.71,32.8) v1(20.71,29.17)
GND:
  vias: v1(18.87,23.62) v1(22.55,27.05) v1(22.99,31.37) v1(23.5,15.24) v1(23.5,13.97) v1(23.5,12.7) v1(23.5,11.43) v1(24.76,15.24) v1(24.76,11.43) v1(26.03,11.43) v1(26.36,32.77) v1(27.31,11.43) v1(28.41,25.4) v1(28.57,11.43) v1(29.78,23.44) v1(29.84,15.24) v1(29.84,11.43) v1(30.24,45.39) v1(30.24,44.37) v1(31.12,15.24) v1(31.12,13.97) v1(31.12,12.7) v1(31.12,11.43) v1(32.51,43.31) v1(32.7,35.23) v1(32.7,20.65) v1(34.29,43.31)
3A3: length 14
  Top Layer w0.508: v1(20.71,26.94) C12.1 U3.5 arc(19.28,30.99) 20.29,30.57 20.71,30.57
  Bottom Layer w0.254: U1.37 20.2,27.44 arc(20.56,27.29) v1(20.71,26.94)
3R0: length 5.5
  Top Layer w0.508: C22.1 C14.1 17.02,27.74 arc(16.74,28.41) U4.2
  Bottom Layer w0.254: U1.36 v1(15.17,26.94)
BOOT: length 2.3
  Bottom Layer w0.254: U1.95 30.92,24.44 arc(30.24,24.72) v1(29.96,25.4)
HSE1: length 11.8
  Bottom Layer w0.254: U1.12 24.64,20.38 24.64,19.05 28.92,14.76 28.92,13.7 arc(28.66,13.05) X1.1 29.69,12.78 arc(29.8,12.74) C23.1
HSE2: length 9.5
  Bottom Layer w0.254: U1.13 24.13,18.8 26.6,16.32 X1.3 24.91,13.88 arc(24.81,13.93) C24.1
KEY1: length 37.6
  Top Layer w0.254: SW1.2 C26.1 32.58,8.89 20.07,8.89 v1(18.54,10.41) R8.2
  Bottom Layer w0.254: v1(18.54,10.41) 18.54,13.19 23.13,17.78 U1.15
KEY2: length 36.9
  Top Layer w0.254: 30.67,5.28 30.67,6.98 29.53,8.13 18.54,8.13 v1(17.02,9.65) R9.2
  Bottom Layer w0.254: v1(17.02,9.65) 17.02,12.42 22.63,18.03 U1.16
KEY3: length 29.7
  Top Layer w0.254: v1(15.44,5.28) C28.1 15.49,7.04 R10.2
  Bottom Layer w0.254: U1.17 22.13,18.29 15.44,11.59 v1(15.44,5.28)
KEY4: length 32
  Top Layer w0.254: v1(11.62,5.28) C29.1 11.62,11.62 13.97,13.97 R11.2
  Bottom Layer w0.254: v1(11.62,5.28) 11.62,8.54 21.63,18.54 U1.18
LED_B: length 18.8
  Top Layer w0.254: R6.2 12.45,19.05 arc(12.59,19.41) 12.95,19.56 25,19.56 arc(26.68,20.26) v1(27.38,21.94)
  Bottom Layer w0.254: U1.7 27.13,21.69 v1(27.38,21.94)
LED_G: length 19.3
  Top Layer w0.254: R5.2 10.92,19.05 arc(11.22,19.77) 11.94,20.07 24.51,20.07 arc(25.83,20.61) v1(26.38,21.94)
  Bottom Layer w0.254: U1.8 26.63,21.69 v1(26.38,21.94)
LED_R: length 20
  Top Layer w0.254: R4.2 9.4,19.05 arc(9.84,20.13) 10.92,20.57 24.01,20.57 arc(24.98,20.97) v1(25.38,21.94)
  Bottom Layer w0.254: U1.9 26.13,21.19 v1(25.38,21.94)
NRST: length 38.2
  Top Layer w0.254: R7.2 v1(20.07,11.18) 21.59,9.65 35.63,9.65 38.29,6.98 38.29,5.28
  Bottom Layer w0.254: v1(20.07,11.18) 20.07,13.96 23.63,17.53 U1.14
PA0: length 22.2
  Bottom Layer w0.254: H1.37 5.72,6.35 17.14,17.78 19.36,17.78 20.63,19.05 U1.20
PA1: length 24
  Bottom Layer w0.254: U1.21 20.13,19.3 19.11,18.29 16.38,18.29 5.72,7.62 3.81,7.62 H1.38
PA2: length 19.8
  Bottom Layer w0.254: U1.22 19.63,19.56 18.87,18.8 15.62,18.8 5.72,8.89 H1.35
PA3: length 20.8
  Bottom Layer w0.254: U1.25 18.13,19.56 17.88,19.3 14.86,19.3 5.72,10.16 3.81,10.16 H1.36
PA4: length 15.9
  Bottom Layer w0.254: U1.26 15.75,21.94 5.24,11.43 H1.33
PA5: length 18.6
  Bottom Layer w0.254: H1.34 3.81,12.7 5.75,12.7 15.49,22.44 U1.27
PA6: length 15.2
  Bottom Layer w0.254: U1.28 15.24,22.94 6.27,13.97 H1.31
PA7: length 18
  Bottom Layer w0.254: H1.32 3.81,15.24 6.79,15.24 14.99,23.44 U1.29
PA8: length 22.8
  Bottom Layer w0.254: U1.69 27.13,36.32 28.4,37.59 36.96,37.59 42.54,43.18 44.45,43.18 H2.9
PA11: length 17.8
  Bottom Layer w0.254: H2.10 42.54,41.91 37.72,37.08 29.14,37.08 28.63,36.58 U1.72
PA12: length 19.7
  Bottom Layer w0.254: U1.73 29.13,36.32 29.38,36.58 38.48,36.58 42.54,40.64 44.45,40.64 H2.11
PA15: length 14.2
  Bottom Layer w0.254: U1.78 32.51,32.94 35.64,36.07 39.24,36.07 42.54,39.37 H2.12
PB0: length 13.9
  Bottom Layer w0.254: U1.32 14.22,24.94 8.33,19.05 H1.27
PB1: length 16.7
  Bottom Layer w0.254: H1.28 3.81,20.32 8.85,20.32 13.97,25.44 U1.33
PB2: length 13.3
  Bottom Layer w0.254: H1.25 9.37,21.59 13.72,25.94 U1.34
PB3: length 12.7
  Bottom Layer w0.254: U1.90 33.78,26.94 36.59,24.13 H2.24
PB4: length 16
  Bottom Layer w0.254: H2.25 44.45,22.86 37.11,22.86 33.53,26.44 U1.91
PB5: length 13.3
  Bottom Layer w0.254: U1.92 33.27,25.94 36.86,22.35 41.78,22.35 42.54,21.59 H2.26
PB6: length 16.7
  Bottom Layer w0.254: U1.93 33.02,25.44 36.62,21.84 41.02,21.84 42.54,20.32 44.45,20.32 H2.27
PB7: length 13.9
  Bottom Layer w0.254: H2.28 42.54,19.05 40.26,21.34 36.37,21.34 32.77,24.94 U1.94
PB9: length 17.1
  Bottom Layer w0.254: H2.29 44.45,17.78 42.54,17.78 39.5,20.83 36.13,20.83 33.02,23.94 U1.96
PB10: length 12.3
  Bottom Layer w0.254: U1.47 15.75,32.44 13.9,34.29 H1.15
PB11: length 15.2
  Bottom Layer w0.254: U1.50 15.75,33.94 14.13,35.56 3.81,35.56 H1.16
PB12: length 14.1
  Bottom Layer w0.254: H1.13 5.72,36.83 5.97,36.58 17.88,36.58 18.13,36.32 U1.51
PB13: length 18.3
  Bottom Layer w0.254: U1.52 18.63,36.58 18.12,37.08 6.73,37.08 5.72,38.1 3.81,38.1 H1.14
PB14: length 16.4
  Bottom Layer w0.254: H1.11 5.72,39.37 7.49,37.59 18.37,37.59 19.13,36.83 U1.53
PB15: length 20.7
  Bottom Layer w0.254: H1.12 3.81,40.64 5.72,40.64 8.25,38.1 18.61,38.1 19.63,37.08 U1.54
PC4: length 14.6
  Bottom Layer w0.254: U1.30 14.73,23.94 7.3,16.51 H1.29
PC5: length 17.3
  Bottom Layer w0.254: U1.31 14.48,24.44 7.82,17.78 3.81,17.78 H1.30
PC6: length 27.5
  Bottom Layer w0.254: H2.5 44.45,48.26 42.54,48.26 33.91,39.62 27.42,39.62 25.13,37.34 U1.65
PC7: length 23.2
  Bottom Layer w0.254: U1.66 25.65,35.51 25.65,37.08 27.69,39.12 34.67,39.12 42.54,46.99 H2.6
PC8: length 25.1
  Bottom Layer w0.254: U1.67 26.13,36.83 27.91,38.61 35.43,38.61 42.54,45.72 44.45,45.72 H2.7
PC9: length 20.9
  Bottom Layer w0.254: H2.8 42.54,44.45 36.19,38.1 28.15,38.1 26.63,36.58 U1.68
PC10: length 16.9
  Bottom Layer w0.254: U1.79 32.77,32.44 35.89,35.56 40,35.56 42.54,38.1 44.45,38.1 H2.13
PC11: length 13.5
  Bottom Layer w0.254: H2.14 42.54,36.83 40.77,35.05 36.13,35.05 33.02,31.94 U1.80
PC12: length 16.3
  Bottom Layer w0.254: H2.15 44.45,35.56 42.54,35.56 41.53,34.54 36.38,34.54 33.27,31.44 U1.81
PD0: length 12.9
  Bottom Layer w0.254: U1.82 33.53,30.94 36.62,34.04 42.29,34.04 42.54,34.29 H2.16
PD1: length 15.6
  Bottom Layer w0.254: H2.17 44.45,33.02 36.36,33.02 33.78,30.44 U1.83
PD2: length 12.2
  Bottom Layer w0.254: H2.18 35.85,31.75 34.04,29.94 U1.84
PD3: length 15
  Bottom Layer w0.254: U1.85 34.29,29.44 35.33,30.48 44.45,30.48 H2.19
PD4: length 11.6
  Bottom Layer w0.254: U1.86 34.54,28.94 34.81,29.21 H2.20
PD5: length 14.8
  Bottom Layer w0.254: U1.87 34.54,28.44 35.04,27.94 44.45,27.94 H2.21
PD6: length 12
  Bottom Layer w0.254: U1.88 34.29,27.94 35.56,26.67 H2.22
PD7: length 15.4
  Bottom Layer w0.254: H2.23 44.45,25.4 36.08,25.4 34.04,27.44 U1.89
PD8: length 18.8
  Bottom Layer w0.254: U1.55 20.13,37.34 18.86,38.61 9.02,38.61 5.72,41.91 H1.9
PD9: length 23
  Bottom Layer w0.254: U1.56 20.63,37.59 19.11,39.12 9.78,39.12 5.72,43.18 3.81,43.18 H1.10
PD10: length 21.1
  Bottom Layer w0.254: U1.57 21.13,37.85 19.35,39.62 10.54,39.62 5.72,44.45 H1.7
PD11: length 25.4
  Bottom Layer w0.254: H1.8 3.81,45.72 5.72,45.72 11.3,40.13 19.6,40.13 21.63,38.1 U1.58
PD12: length 23.5
  Bottom Layer w0.254: H1.5 5.72,46.99 12.06,40.64 19.84,40.64 22.13,38.35 U1.59
PD13: length 27.7
  Bottom Layer w0.254: H1.6 3.81,48.26 5.72,48.26 12.83,41.15 20.09,41.15 22.63,38.61 U1.60
PD14: length 25.8
  Bottom Layer w0.254: H1.3 5.72,49.53 13.59,41.66 20.34,41.66 23.13,38.86 U1.61
PD15: length 30.1
  Bottom Layer w0.254: H1.4 3.81,50.8 5.72,50.8 14.35,42.16 20.58,42.16 23.63,39.12 U1.62
PE0: length 14.4
  Bottom Layer w0.254: H2.30 42.54,16.51 38.73,20.32 35.89,20.32 32.77,23.44 U1.97
PE1: length 17.8
  Bottom Layer w0.254: U1.98 32.51,22.94 35.64,19.81 37.97,19.81 42.54,15.24 44.45,15.24 H2.31
PE2: length 40.8
  Top Layer w0.254: H2.32 42.54,13.97 40,11.43 v1(35.56,11.43) ; 24.88,5.05 v1(24.88,3.18)
  Bottom Layer w0.254: U1.1 30.13,19.56 30.38,19.3 37.21,19.3 42.54,13.97 H2.32 ; v1(35.56,11.43) 33.13,11.43 v1(24.88,3.18)
PE3: length 46.6
  Top Layer w0.254: H2.33 44.45,12.7 42.54,12.7 40.64,10.8 v1(36.19,10.8) ; 25.88,5.05 v1(25.88,3.18)
  Bottom Layer w0.254: H2.33 44.45,12.7 42.54,12.7 36.45,18.8 30.14,18.8 29.63,19.3 U1.2 ; v1(25.88,3.18) 33.5,10.8 v1(36.19,10.8)
PE4: length 47.4
  Top Layer w0.254: v1(22.63,1.27) 22.63,3.44 23.38,4.19 FPC1.3 ; H2.34 42.54,11.43 41.28,10.16 v1(36.83,10.16)
  Bottom Layer w0.254: v1(36.83,10.16) 34.13,10.16 26.51,2.54 23.9,2.54 v1(22.63,1.27) ; U1.3 29.13,19.05 29.89,18.29 35.69,18.29 42.54,11.43 H2.34
PE5: length 52.9
  Top Layer w0.254: v1(37.47,9.53) 41.91,9.53 42.54,10.16 44.45,10.16 H2.35 ; v1(24.13,1.27) 23.37,2.03 23.37,3.56 23.88,4.07 FPC1.4
  Bottom Layer w0.254: v1(37.47,9.53) 34.77,9.53 27.15,1.91 24.76,1.91 v1(24.13,1.27) ; H2.35 44.45,10.16 42.54,10.16 34.92,17.78 29.65,17.78 28.63,18.8 U1.4
PE6: length 46.1
  Top Layer w0.254: v1(25.63,1.27) 24.13,2.77 24.13,3.69 24.38,3.94 FPC1.5 ; v1(38.1,8.89) H2.36
  Bottom Layer w0.254: H2.36 42.54,8.89 34.16,17.27 29.4,17.27 28.13,18.54 U1.5 ; v1(38.1,8.89) 35.41,8.89 27.78,1.27 v1(25.63,1.27)
PE7: length 16.7
  Bottom Layer w0.254: H1.26 3.81,22.86 9.91,22.86 14.99,27.94 U1.38
PE8: length 13.3
  Bottom Layer w0.254: U1.39 14.73,28.44 10.42,24.13 H1.23
PE9: length 16
  Bottom Layer w0.254: U1.40 14.48,28.94 10.94,25.4 3.81,25.4 H1.24
PE10: length 12.6
  Bottom Layer w0.254: U1.41 14.22,29.44 11.45,26.67 H1.21
PE11: length 15.4
  Bottom Layer w0.254: U1.42 13.97,29.94 11.97,27.94 3.81,27.94 H1.22
PE12: length 12
  Bottom Layer w0.254: U1.43 16.54,30.48 13.72,30.48 12.45,29.21 H1.19
PE13: length 14.8
  Bottom Layer w0.254: U1.44 13.46,30.94 13,30.48 3.81,30.48 H1.20
PE14: length 11.6
  Bottom Layer w0.254: H1.17 14.93,31.75 15.24,31.44 U1.45
PE15: length 15
  Bottom Layer w0.254: H1.18 3.81,33.02 14.41,33.02 15.49,31.94 U1.46
PF2: length 26.4
  Bottom Layer w0.254: U1.19 21.13,18.8 19.61,17.27 17.91,17.27 5.72,5.08 3.81,5.08 H1.40
PF9: length 26.4
  Bottom Layer w0.254: U1.10 25.63,19.56 28.42,16.76 33.4,16.76 42.54,7.62 44.45,7.62 H2.37
PF10: length 24.5
  Bottom Layer w0.254: H2.38 42.54,6.35 32.64,16.26 28.19,16.26 25.15,19.3 25.15,20.37 U1.11
SWCLK: length 28
  Top Layer w0.254: H3.1 39.37,38.02 arc(37.88,34.43) 34.29,32.94 v1(30.13,32.94)
  Bottom Layer w0.254: U1.77 30.63,33.44 arc(30.28,33.29) v1(30.13,32.94)
SWDIO: length 25.3
  Top Layer w0.254: v1(30.13,33.94) 34.29,33.94 arc(36.09,34.68) 36.83,36.48 H3.2
  Bottom Layer w0.254: U1.76 v1(30.13,33.94)
UART1_RX: length 17.5
  Top Layer w0.254: U5.6 20.07,40.64 arc(21.86,41.38) v1(22.61,43.18)
  Inner1 w0.254: v1(22.61,43.18) v1(28.38,33.94)
  Bottom Layer w0.254: U1.71 28.13,34.19 arc(28.2,34.01) v1(28.38,33.94)
UART1_TX: length 15.7
  Top Layer w0.254: U5.7 20.32,41.91 arc(21.22,42.28) v1(21.59,43.18)
  Inner1 w0.254: v1(21.59,43.18) v1(27.38,33.94)
  Bottom Layer w0.254: U1.70 27.63,34.19 arc(27.56,34.01) v1(27.38,33.94)
USB_DN: length 12.4
  Top Layer w0.254: USB1.A7 16.26,50.04 arc(16.41,50.39) 16.76,50.54 arc(17.11,50.39) 17.26,50.04 USB1.B7 v1(17.26,47.61) ; U5.2 14.99,41.91 arc(15.88,42.28) v1(16.26,43.18)
  Inner1 w0.254: v1(17.26,47.61) v1(16.26,43.18)
USB_DP: length 10.6
  Top Layer w0.254: USB1.A6 16.76,48.62 arc(16.61,48.27) 16.26,48.12 arc(15.91,48.27) 15.76,48.62 USB1.B6 v1(15.76,47.61) ; U5.1 v1(15.24,43.18)
  Inner1 w0.254: v1(15.76,47.61) v1(15.24,43.18)
$1N5162: length 2
  Top Layer w0.254: 7.62,2.32 9.43,2.32 arc(9.5,2.35) R3.1
$1N5238: length 2
  Top Layer w0.254: R4.1 9.4,15.04 arc(9.4,15.03) LED1.1
$1N5301: length 2
  Top Layer w0.254: R5.1 10.92,15.04 arc(10.92,15.03) LED1.4
$1N5327: length 3.7
  Top Layer w0.254: R6.1 12.45,15.72 arc(12,14.63) LED1.3
$1N6659: length 1.9
  Top Layer w0.254: FPC1.1 21.27,5.05 arc(20.92,5.2) R12.2

## Copper pours and planes (outline as drawn; the poured copper is in the pictures)
AGND on Top Layer: 12.45,37.47 21.59,37.47 21.59,24.77 12.45,24.77
AGND on 内层2: 0.26,55.62 48,55.62 48,0.26 0.26,0.26
GND on Top Layer: 0,55.88 48.26,55.88 48.26,0 0,0
GND on Bottom Layer: 0,55.88 48.26,55.88 48.26,0 0,0
GND on Inner1: 0,55.88 48.26,55.88 48.26,0 0,0

## Text on the board
Bottom Silkscreen Layer: C6 / C7 | C8 / C9 | A8 / A11 | A12 / A15 | C10 / C11 | C12 / D0 | D1 / D2 | D3 / D4 | D5 / D6 | D7 / B3 | B4 / B5 | B6 / B7 | B9 / E0 | E1 / E2 | E3 / E4 | E5 / E6 | F9 / F10 | D14 / D15 | D12 / D13 | D10 / D11 | D8 / D9 | B14 / B15 | B12 / B13 | B10 / B11 | E14 / E15 | E12 / E13 | E10 / E11 | E8 / E9 | B2 / E7 | B0 / B1 | C4 / C5 | A6 / A7 | A4 / A5 | A2 / A3 | A0 / A1 | AGND / F2 | JLCJLCJLCJLC | KEY4 | KEY3 | KEY2 | KEY1 | RST | USB (UART1) | AGND | GND | 5V0 | 24 MHz | DIO | CLK | 3V3 | G474VET6 | @ Penguins
Top Silkscreen Layer: V3.1 | TFTLCD Pins / PE2: SCL / PE3: CS / PE4: RST / PE5: RS / PE6: SDA | D15 / D14 | D13 / D12 | D11 / D10 | D9 / D8 | B15 / B14 | B13 / B12 | B11 / B10 | E15 / E14 | E13 / E12 | E11 / E10 | E9 / E8 | E7 / B2 | B1 / B0 | C5 / C4 | A7 / A6 | A5 / A4 | A3 / A2 | A1 / A0 | F2 | AGND | C7 / C6 | C9 / C8 | A11 / A8 | A15 / A12 | C11 / C10 | D0 / C12 | D2 / D1 | D4 / D3 | D6 / D5 | B3 / D7 | B5 / B4 | B7 / B6 | E0 / B9 | E2 / E1 | E4 / E3 | E6 / E5 | F10 / F9 | 5V0 | GND | DIO | CLK | 24 MHz | TFTLCD (SPI4) | 3V3 | KEY4 | KEY3 | KEY2 | KEY1 | RST | USB (UART1)
